# EasyEDA Pro project stm32f103c8t6.eprj, board PCB3_1
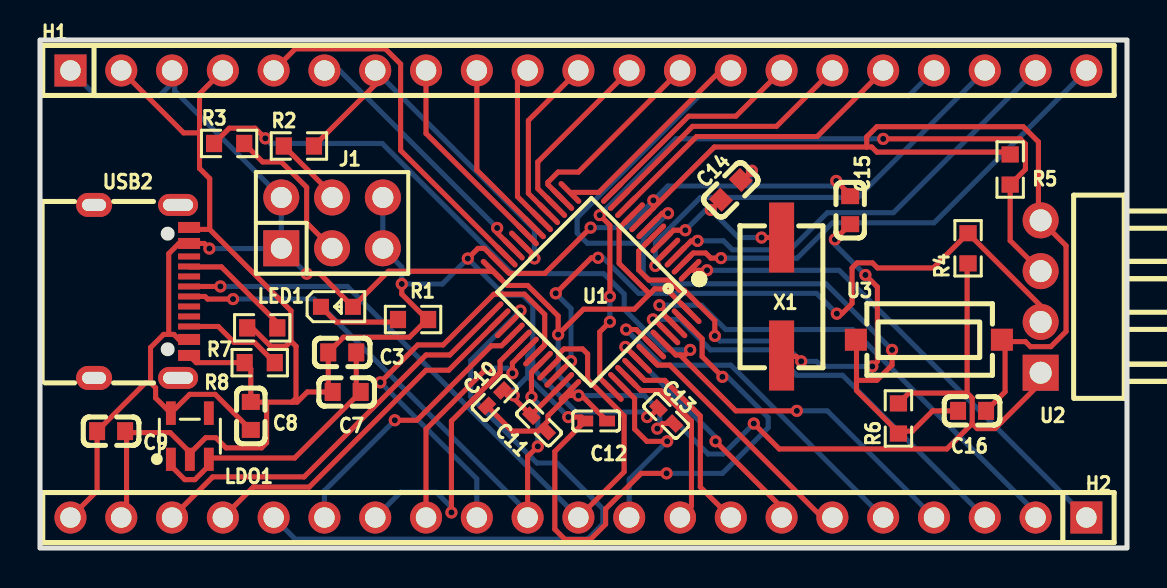
[diagram p6: board, top side]
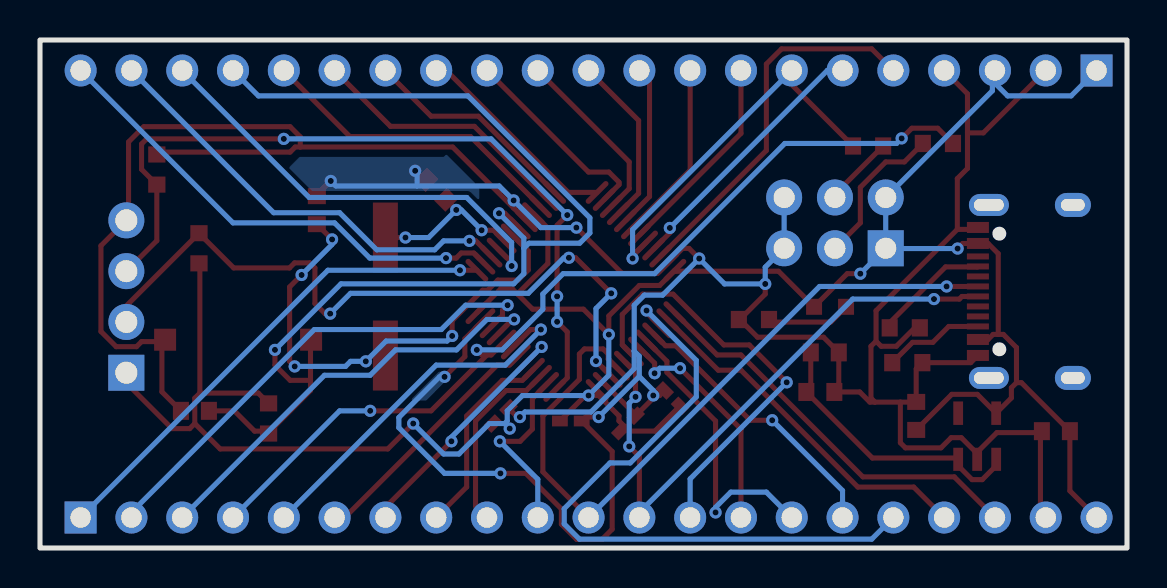
[diagram p7: board, bottom side, seen from below]

Outline 54.36 x 25.4 mm; copper layers: Top Layer, Bottom Layer. Coordinates in mm from the lower left corner of the outline.
Outline path: rectangle 0,25.4 54.36,0
Stack: Top Layer 0.035mm / Dielectric1 1.51mm FR4 er 4.5 / Bottom Layer 0.035mm

## Design rules (mm)
template: JLCPCB Capability(Two Layers Board)
spacing copperThickness1oz (default): track to track 0.102, other pairs 0.152 to 0.3
spacing copperThickness2oz: track to track 0.203, other pairs 0.152 to 0.3
track width copperThickness1oz (default): min 0.127, default 0.254, max 2.54
track width copperThickness2oz: min 0.203, default 0.254, max 2.54
differential pair differentialPair (default): width min 0.127, default 0.254, max 2.54; gap min 0.152, default 0.152
via viaSize (default): diameter min 0.5, default 0.61, max 10; hole min 0.3, default 0.305, max 6.3

## Placement (name value [footprint] x y rotation side)
C3  0.1UF  [C0603]  15.11 9.78 0 top
C7  1uF  [C0603]  15.33 7.8 0 top
C8  1uF  [C0603]  10.54 6.6 270 top
C9  0.1UF  [C0603]  3.56 5.84 180 top
C10  100nF  [C0402]  22.73 7.49 225 top
C11  100nF  [C0402]  24.95 6.23 315 top
C12  100nF  [C0402]  27.81 6.35 0 top
C13  100nF  [C0402]  31.31 6.61 315 top
C14  18pF  [C0603]  34.54 17.91 225 top
C15  18pF  [C0603]  40.51 16.89 270 top
C16  0.1UF  [C0603]  46.61 6.86 0 top
H1  HC-PZ254-11.5L-1x21PZ  [HDR-TH_21P-P2.54-V-M]  26.92 23.88 0 top
H2  HC-PZ254-11.5L-1x21PZ  [HDR-TH_21P-P2.54-V-M]  26.92 1.52 180 top
J1  2.54-2*3P针  [HDR-TH_6P-P2.54-V-M-R2-C3-S2.54-1]  14.61 16.26 0 top
LDO1  ME6211C33M5G-N  [SOT-23-5_L3.0-W1.7-P0.95-LS2.8-BL]  7.49 5.59 0 top
LED1  NCD0603Y2  [LED0603-RD]  14.85 12.06 0 top
R1  1kΩ  [R0603]  18.66 11.42 0 top
R2  10kΩ  [R0603]  12.95 20.1 0 top
R3  10kΩ  [R0603]  9.46 20.23 0 top
R4  10kΩ  [R0603]  46.41 14.99 270 top
R5  10kΩ  [R0603]  48.51 18.92 270 top
R6  10kΩ  [R0603]  42.93 6.48 90 top
R7  5.1kΩ  [R0603]  11.11 11.01 0 top
R8  5.1kΩ  [R0603]  10.99 9.27 0 top
U1  STM32F103C8T6  [LQFP-48_L7.0-W7.0-P0.50-LS9.0-BL]  27.56 12.83 135 top
U2  2541WR-04P  [HDR-TH_4P-P2.54-H-M-W10.4-N]  50.04 12.57 90 top
U3  KEYRESET  [SW-SMD_HX-TS-1101-C-W]  44.45 10.41 0 top
USB2  TYPE-C 16PIN 2MD(073)  [USB-C-SMD_TYPE-C-6PIN-2MD-073]  5.08 12.83 270 top
X1  8MHz  [CRYSTAL-SMD_L7.0-W4.1-LS7.6]  37.08 12.57 90 top

## Footprints (pads in the part's own frame, mm; a bottom-side part is the same pattern mirrored in y, then rotated)
C0402
  rect 0.79x0.54 smd: 1(-0.545,0) 2(0.545,0)
C0603
  rect 0.8x0.9 smd: 1(-0.7,0) 2(0.7,0)
CRYSTAL-SMD_L7.0-W4.1-LS7.6
  rect 3.5x1.25 smd: 1(-2.95,0) 2(2.95,0)
HDR-TH_4P-P2.54-H-M-W10.4-N
  rect 1.8x1.8 hole 1.1: 1(-3.81,0)
  round 1.8 hole 1.1: 2(-1.27,0) 3(1.27,0) 4(3.81,0)
HDR-TH_6P-P2.54-V-M-R2-C3-S2.54-1
  rect 1.8x1.8 hole 1.05: 1(-2.54,-1.27)
  round 1.8 hole 1.05: 2(-2.54,1.27) 3(0,-1.27) 4(0,1.27) 5(2.54,-1.27) 6(2.54,1.27)
HDR-TH_21P-P2.54-V-M
  rect 1.6x1.6 hole 1.02: 1(-25.4,0)
  round 1.6 hole 1.02: 2(-22.86,0) 3(-20.32,0) 4(-17.78,0) 5(-15.24,0) 6(-12.7,0) 7(-10.16,0) 8(-7.62,0) 9(-5.08,0) 10(-2.54,0) 11(0,0) 12(2.54,0) 13(5.08,0) 14(7.62,0) 15(10.16,0) 16(12.7,0) 17(15.24,0) 18(17.78,0) 19(20.32,0) 20(22.86,0) 21(25.4,0)
LED0603-RD
  rect 0.8x0.8 smd: 1(-0.799,0) 2(0.799,0)
LQFP-48_L7.0-W7.0-P0.50-LS9.0-BL
  oval 0.27x1.5 smd: 1(-2.75,-4.25) 2(-2.25,-4.25) 3(-1.75,-4.25) 4(-1.25,-4.25) 5(-0.75,-4.25) 6(-0.25,-4.25) 7(0.25,-4.25) 8(0.75,-4.25) 9(1.25,-4.25) 10(1.75,-4.25) 11(2.25,-4.25) 12(2.75,-4.25) 25(2.75,4.25) 26(2.25,4.25) 27(1.75,4.25) 28(1.25,4.25) 29(0.75,4.25) 30(0.25,4.25) 31(-0.25,4.25) 32(-0.75,4.25) 33(-1.25,4.25) 34(-1.75,4.25) 35(-2.25,4.25) 36(-2.75,4.25)
  oval 1.5x0.27 smd: 13(4.25,-2.75) 14(4.25,-2.25) 15(4.25,-1.75) 16(4.25,-1.25) 17(4.25,-0.75) 18(4.25,-0.25) 19(4.25,0.25) 20(4.25,0.75) 21(4.25,1.25) 22(4.25,1.75) 23(4.25,2.25) 24(4.25,2.75) 37(-4.25,2.75) 38(-4.25,2.25) 39(-4.25,1.75) 40(-4.25,1.25) 41(-4.25,0.75) 42(-4.25,0.25) 43(-4.25,-0.25) 44(-4.25,-0.75) 45(-4.25,-1.25) 46(-4.25,-1.75) 47(-4.25,-2.25) 48(-4.25,-2.75)
R0603
  rect 0.806x0.864 smd: 1(-0.753,0) 2(0.753,0)
SOT-23-5_L3.0-W1.7-P0.95-LS2.8-BL
  rect 0.49x1.157 smd: 1(-0.95,-1.153) 2(0,-1.153) 3(0.95,-1.153)
  rect 0.49x1.175 smd: 4(0.95,1.153) 5(-0.95,1.153)
SW-SMD_HX-TS-1101-C-W
  rect 1.1x1.1 smd: 1(-3.65,0) 2(3.65,0)
USB-C-SMD_TYPE-C-6PIN-2MD-073
  rect 0.55x1.1 smd: 1(-3.2,2.375) 2(-2.4,2.375) 11(2.4,2.375) 12(3.2,2.375)
  rect 0.3x1.1 smd: 3(-1.75,2.375) 4(-1.25,2.375) 5(-0.75,2.375) 6(-0.25,2.375) 7(0.25,2.375) 8(0.75,2.375) 9(1.25,2.375) 10(1.75,2.375)
  oval 1.1x2 hole 0.6x1.5: 13(-4.325,1.825) 14(4.325,1.825)
  oval 1.2x1.8 hole 0.6x1.2: 13(-4.325,-2.375) 14(4.325,-2.375)

## Nets
+5V: C3.2 C7.2 LDO1.1 LDO1.3
GND: C3.1 C7.1 C8.1 C9.1 C10.1 C11.1 C12.1 C13.1 C14.1 C15.1 C16.2 H1.2 H1.4 H2.20 J1.5 J1.6 LDO1.2 R1.2 R5.1 R7.1 R8.1 U1.8 U1.23 U1.35 U1.47 U2.4 U3.2 USB2.1 USB2.12
VBAT: H2.1 U1.1
VCC: C8.2 C9.2 C10.2 C11.2 C12.2 C13.2 H1.1 H1.3 H2.21 J1.1 J1.2 LDO1.5 LED1.2 R4.2 R6.2 U1.9 U1.24 U1.36 U1.48 U2.1 USB2.2 USB2.11
BOOT0: H2.4 R3.1 U1.44
BOOT1: H1.7 R2.2 U1.20
OSCIN: C14.2 U1.5 X1.2
OSOUT: C15.2 U1.6 X1.1
PA0: H1.17 U1.10
PA1: H1.16 U1.11
PA2: H1.15 U1.12
PA3: H1.14 U1.13
PA4: H1.13 U1.14
PA5: H1.12 U1.15
PA6: H1.11 U1.16
PA7: H1.10 U1.17
PA8: H2.15 U1.29
PA9: H2.14 U1.30
PA10: H2.13 U1.31
PA11: H2.12 U1.32 USB2.7
PA12: H2.11 U1.33 USB2.6
PA15: H2.10 U1.38
PB0: H1.9 U1.18
PB1: H1.8 U1.19
PB3: H2.9 U1.39
PB4: H2.8 U1.40
PB5: H2.7 U1.41
PB6: H2.6 U1.42
PB7: H2.5 U1.43
PB8: H2.3 U1.45
PB9: H2.2 U1.46
PB10: H1.6 U1.21
PB11: H1.5 U1.22
PB12: H2.19 U1.25
PB13: H2.18 U1.26
PB14: H2.17 U1.27
PB15: H2.16 U1.28
PC13: H1.21 U1.2
PC14: H1.20 U1.3
PC15: H1.19 U1.4
RESET: C16.1 H1.18 R6.1 U1.7 U3.1
SWCLK: R5.2 U1.37 U2.3
SWIO: R4.1 U1.34 U2.2
$1N1581: LED1.1 R1.1
$1N1591: J1.3 R3.2
$1N1592: J1.4 R2.1
$1N3762: R7.2 USB2.4
$1N3875: R8.2 USB2.10

Pads without a net: LDO1 4; USB2 3 5 8 9 13 14

## Via types
v1: diameter 0.61, hole 0.305, Top Layer to Bottom Layer, 60 vias

## Routing (per net, layer and track width the routed paths; a pad name or vN(x,y) marks a point on that pad's centre or on a via; arc(x,y) is an arc through that point)
+5V: length 14.3
  Top Layer w0.254: 8.51,4.5 LDO1.3 ; 8.51,4.5 8.51,4.18 7.75,3.42 7.24,3.42 6.54,4.11 LDO1.1 ; 8.51,4.5 12.73,4.5 C7.2 15.81,8.02 C3.2
GND: length 194.9
  Top Layer w0.254: C13.1 30.48,6.55 v1(30.36,6.55) ; 8.48,15.93 8.48,18.47 7.98,18.98 7.98,20.76 ; 8.48,15.93 7.55,15.93 USB2.1 ; 8.48,15.93 12.55,11.87 12.55,10.34 ; 12.55,10.34 12.3,10.09 11.53,10.09 10.61,11.01 R7.1 ; 12.55,10.34 12.8,10.09 12.8,7.49 12.6,7.29 ; v1(27.54,16.02) 25.25,13.73 23.47,13.73 22.22,14.98 21.9,14.98 v1(21.39,14.47) ; 24.45,6.73 C11.1 ; 24.45,6.73 23.69,7.49 v1(23.69,7.62) 23.37,7.62 C10.1 ; 24.45,6.73 24.64,6.73 26.14,8.23 ; v1(26.42,6.55) 27.07,6.55 C12.1 25.74,4.83 25.74,0.94 26.25,0.43 27.52,0.43 28.28,1.19 28.28,1.95 30.06,3.73 v1(31.33,3.73) ; v1(18.09,13.2) 18.09,12.69 19.36,11.42 ; 48.26,10.32 49.28,10.32 49.53,10.07 50.55,10.07 51.31,10.83 51.31,15.11 U2.4 49.93,16.49 49.93,20.3 49.17,21.07 41.85,21.07 41.34,20.56 41.34,20.05 ; 48.26,10.32 48.26,7.81 C16.2 ; 48.26,10.32 48.19,10.32 U3.2 ; 4.06,1.52 4.33,1.79 4.33,5.77 ; 12.6,7.29 12.86,7.29 13.36,7.8 C7.1 14.41,8.02 C3.1 15.17,10.54 18.48,10.54 19.36,11.42 ; 12.6,7.29 11.33,7.29 ; U1.47 33.11,10.46 33.11,9.57 v1(34.13,8.56) ; 41.34,20.05 41.59,20.05 41.85,19.8 48.4,19.8 R5.1 ; 41.34,20.05 33.72,20.05 30.67,17 ; C15.1 40.32,17.85 v1(39.82,18.35) ; 11.33,7.29 11.33,5.26 11.08,5.01 9.3,5.01 8.79,5.52 8.29,5.52 7.52,4.75 ; 11.33,7.29 10.55,7.29 C8.1 10.54,8.96 R8.1 7.81,9.27 USB2.12 ; 7.98,20.76 7.18,20.76 4.06,23.88 ; 7.98,20.76 7.98,22.71 H1.4 ; 19.36,11.42 R1.2 ; 7.52,4.75 7.52,4.46 LDO1.2 ; 7.52,4.75 6.51,5.77 4.33,5.77 ; 4.33,5.77 C9.1 ; C14.1 35.34,18.61 v1(35.6,18.86) ; 30.67,17 U1.8 ; 30.67,17 v1(30.67,17.38)
  Bottom Layer w0.254: 24.64,9.85 24.64,12.13 24.13,12.64 23.22,12.64 v1(21.39,14.47) 20.12,13.2 v1(18.09,13.2) 18.09,14.04 J1.5 J1.6 ; 24.64,9.85 24.39,9.59 24.39,8.58 ; 24.64,9.85 24.64,8.96 26.8,6.8 30.11,6.8 v1(30.36,6.55) ; v1(39.82,18.35) 39.56,18.1 35.5,18.1 ; v1(31.33,3.73) 34.13,3.73 36.41,6.02 36.41,6.53 34.38,8.56 v1(34.13,8.56) ; v1(35.6,18.86) 35.5,18.76 35.5,18.1 ; v1(27.54,16.02) 29.31,16.02 v1(30.67,17.38) 31.39,18.1 35.5,18.1 ; v1(23.69,7.62) 23.69,7.88 24.39,8.58 ; 24.39,8.58 v1(26.42,6.55)
VBAT: length 24.9
  Top Layer w0.254: v1(33.36,13.89) U1.1
  Bottom Layer w0.254: H2.1 39.96,13.89 v1(33.36,13.89)
VCC: length 130.6
  Top Layer w0.254: U1.48 31.32,12.96 30.74,12.96 30.48,12.7 ; R6.2 43.44,7.75 46.36,7.75 ; 26.75,7.62 v1(26.93,7.62) 27.08,7.62 C12.2 ; 26.75,7.62 U1.36 ; 26.75,7.62 26.42,7.62 25.4,6.61 25.4,6.35 25.15,6.1 ; 25.15,6.1 24.9,5.85 23.61,5.85 C10.2 ; 25.15,6.1 C11.2 ; v1(35.69,6.22) 36.96,4.95 45.35,4.95 46.62,6.22 ; v1(13.33,13.72) 13.99,13.72 15.65,12.06 17.43,13.84 22.56,13.84 U1.24 23.37,13.13 24.39,13.13 25.91,11.6 v1(25.91,10.67) 27.18,11.94 29.72,11.94 30.48,12.7 ; v1(30.87,5.97) 31.12,6.22 31.7,6.22 ; 30.48,12.7 28.96,14.23 28.96,16 U1.9 ; 46.36,7.75 46.62,7.49 46.62,6.22 ; 46.36,7.75 46.36,14.19 R4.2 ; v1(8.47,14.97) 8.22,15.23 USB2.2 6.95,15.23 6.44,14.72 6.44,10.68 ; 46.62,6.22 46.87,5.97 47.75,5.97 50.04,8.26 U2.1 ; 5.53,8.27 5.78,8.01 5.78,7.5 LDO1.5 7.48,7.68 8.76,7.68 C8.2 ; 5.53,8.27 5.53,10.02 6.19,10.68 6.44,10.68 ; 5.53,8.27 5.28,8.27 C9.2 2.86,2.86 1.52,1.52 ; 6.44,10.68 6.69,10.68 6.95,10.43 USB2.11
  Bottom Layer w0.254: 1.52,23.88 2.79,22.61 5.97,22.61 6.73,23.37 ; H1.3 6.73,23.75 6.73,23.37 ; 31.12,6.22 v1(30.87,5.97) ; 31.12,6.22 31.88,6.22 33.41,4.7 34.17,4.7 v1(35.69,6.22) ; 31.12,6.22 30.99,6.35 30.99,6.86 30.23,7.62 v1(26.93,7.62) 25.91,8.64 v1(25.91,10.67) ; J1.1 12.05,14.97 v1(8.47,14.97) ; J1.1 v1(13.33,13.72) ; J1.1 J1.2 6.73,22.86 6.73,23.37
BOOT0: length 47
  Top Layer w0.254: U1.44 31.79,9.65 32,9.65 ; v1(32.51,9.91) 32.26,9.65 32,9.65 ; R3.1 9.47,20.99 10.76,20.99 v1(11.27,20.48) ; 32,9.65 34.8,6.86 v1(37.85,6.86)
  Bottom Layer w0.254: H2.4 39.37,6.86 v1(37.85,6.86) ; v1(32.51,9.91) 31.24,9.91 29.21,11.94 29.21,12.7 28.19,13.72 23.62,13.72 17.11,20.23 11.52,20.23 v1(11.27,20.48)
BOOT1: length 18.9
  Top Layer w0.254: v1(24.72,14.48) 24.72,14.6 U1.20 ; R2.2 16.76,23.16 H1.7
  Bottom Layer w0.254: H1.7 24.72,15.92 v1(24.72,14.48)
OSCIN: length 7.9
  Top Layer w0.254: C14.2 v1(33.54,16.9) ; v1(36.08,15.52) X1.2 ; v1(32.27,15.89) 31.68,15.89 U1.5
  Bottom Layer w0.254: v1(32.27,15.89) 33.29,16.9 v1(33.54,16.9) 34.92,15.52 v1(36.08,15.52)
OSOUT: length 25.7
  Top Layer w0.254: X1.1 37.3,9.59 37.81,9.59 v1(38.06,9.33) ; v1(33.75,10.6) 33.75,11.37 32.22,12.89 31.97,12.89 31.46,13.4 30.44,13.4 29.94,13.91 29.94,14.85 U1.6 ; C15.2 v1(39.75,15.43) ; v1(41.62,9.08) 41.87,9.33 41.87,13.05 v1(41.27,13.65)
  Bottom Layer w0.254: v1(39.75,15.43) 39.75,15.18 v1(41.27,13.65) ; v1(33.75,10.6) 34,10.35 37.05,10.35 v1(38.06,9.33) 38.83,9.33 39.08,9.08 v1(41.62,9.08)
PA0: length 15.7
  Top Layer w0.254: H1.17 38.86,20.57 32.83,20.57 U1.10
PA1: length 13.3
  Top Layer w0.254: U1.11 32.63,21.08 36.83,21.08 39.62,23.88
PA2: length 11
  Top Layer w0.254: U1.12 32.43,21.59 34.8,21.59 37.08,23.88
PA3: length 10.6
  Top Layer w0.254: 26.5,17.78 27.94,17.78 34.04,23.88 H1.14
PA4: length 10.1
  Top Layer w0.254: U1.14 25.4,18.17 25.4,18.29 25.91,18.8 26.92,18.8 H1.13
PA5: length 9.1
  Top Layer w0.254: 29.46,23.88 24.89,19.3 24.89,17.97 U1.15
PA6: length 8.6
  Top Layer w0.254: H1.11 24.42,21.37 24.42,17.73 U1.16
PA7: length 8.2
  Top Layer w0.254: U1.17 23.88,17.57 23.88,23.37 H1.10
PA8: length 14.9
  Top Layer w0.254: v1(20.57,1.78) 20.57,6.35 23.01,8.78 23.01,9.34 U1.29
  Bottom Layer w0.254: v1(20.57,1.78) 20.57,2.03 19.81,2.79 18.03,2.79 H2.15
PA9: length 11.7
  Top Layer w0.254: 19.3,1.52 19.3,5.94 v1(22.35,8.99) ; U1.30 23.62,9.24 v1(23.62,8.74)
  Bottom Layer w0.254: v1(22.35,8.99) 23.37,8.99 v1(23.62,8.74)
PA10: length 21.5
  Top Layer w0.254: v1(17.02,8.28) 18.89,10.15 20.16,10.15 22.7,12.69 24.22,12.69 25.24,11.68 25.24,10.15 24.73,9.65
  Bottom Layer w0.254: v1(17.02,8.28) 21.84,3.46 21.84,1.52
PA11: length 30
  Top Layer w0.254: v1(24.58,7.56) 24.58,8.78 U1.32 ; v1(24.89,5.08) 24.38,4.57 H2.12 ; v1(9.65,12.45) 8.38,12.45 8.25,12.58 USB2.7
  Bottom Layer w0.254: H2.12 24.38,1.78 13.72,12.45 v1(9.65,12.45) ; v1(24.58,7.56) 24.89,7.24 v1(24.89,5.08)
PA12: length 36.8
  Top Layer w0.254: v1(9.02,13.08) USB2.6 ; U1.33 25.95,9.45 25.95,9.7 26.2,9.95 27.13,9.95 27.38,9.7 27.38,8.43 29.21,6.6 29.21,3.81 H2.11
  Bottom Layer w0.254: H2.11 15.37,13.08 v1(9.02,13.08)
PA15: length 9.1
  Top Layer w0.254: 28.97,8.23 29.73,7.47 29.73,5.95 30.35,5.33 v1(31.36,5.33)
  Bottom Layer w0.254: v1(31.36,5.33) 29.46,3.44 29.46,1.52
PB0: length 9.1
  Top Layer w0.254: U1.18 21.84,18.9 21.84,23.88
PB1: length 10.3
  Top Layer w0.254: U1.19 19.3,20.73 19.3,23.88
PB3: length 9.2
  Top Layer w0.254: H2.9 32.58,2.1 32.58,6.35 31.05,7.87 30.04,7.87 U1.39
PB4: length 10
  Top Layer w0.254: U1.40 30.24,8.38 31.24,8.38 33.02,6.6 33.02,3.05 H2.8
PB5: length 12.8
  Top Layer w0.254: v1(33.78,5.33) 37.08,2.03 37.08,1.52 ; v1(29.27,10.05) U1.41
  Bottom Layer w0.254: v1(29.27,10.05) 33.78,5.54 v1(33.78,5.33)
PB6: length 12.6
  Top Layer w0.254: 39.62,1.52 39.12,1.52 31.5,9.14 30.89,9.14 30.39,9.65
PB7: length 18.6
  Top Layer w0.254: v1(29.31,10.92) 29.82,10.92 U1.43
  Bottom Layer w0.254: H2.5 34.54,9.14 31.09,9.14 v1(29.31,10.92)
PB8: length 21.8
  Top Layer w0.254: U1.45 30.72,11.43 v1(30.65,11.43)
  Bottom Layer w0.254: v1(30.65,11.43) 32,11.43 33.53,9.91 36.58,9.91 37.85,8.64 40.13,8.64 47.24,1.52
PB9: length 24.8
  Top Layer w0.254: U1.46 31.23,11.63 31.23,11.89 v1(30.97,12.14)
  Bottom Layer w0.254: v1(30.97,12.14) 33.07,12.14 34.29,10.92 40.64,10.92 49.78,1.78 H2.2
PB10: length 13.3
  Top Layer w0.254: v1(22.86,16) 22.86,15.76 U1.21
  Bottom Layer w0.254: H1.6 14.99,23.88 v1(22.86,16)
PB11: length 18.9
  Top Layer w0.254: 11.68,23.88 12.77,24.96 17.27,24.96 18.03,24.2 18.03,19.88 U1.22
PB12: length 20.2
  Top Layer w0.254: U1.25 20.5,9.65 19.3,9.65 13.21,3.56 8.64,3.56 H2.19
PB13: length 17.9
  Top Layer w0.254: U1.26 20.44,8.89 19.3,8.89 13.46,3.05 10.67,3.05 H2.18
PB14: length 33.4
  Top Layer w0.254: v1(24.03,11.87) 24.03,11.77 U1.27
  Bottom Layer w0.254: 11.68,1.52 12.77,0.44 27.38,0.44 28.14,1.21 28.14,1.97 25.86,4.25 24.84,4.25 21.54,7.56 21.54,9.38 v1(24.03,11.87)
PB15: length 14
  Top Layer w0.254: v1(17.74,6.39) 18.84,6.39 22.57,10.11 23.08,10.11 U1.28
  Bottom Layer w0.254: v1(17.74,6.39) 14.22,2.87 H2.16
PC13: length 24.4
  Top Layer w0.254: 32.16,14.24 32.66,14.75 33.29,14.75 33.55,14.5 v1(34.05,14.5)
  Bottom Layer w0.254: v1(34.05,14.5) 37.86,14.5 39.62,16.26 44.7,16.26 H1.21
PC14: length 22.2
  Top Layer w0.254: v1(32.88,15.36) 32.56,15.36 U1.3
  Bottom Layer w0.254: H1.20 42.67,16.76 39.37,16.76 37.52,14.91 34.62,14.91 34.17,15.36 v1(32.88,15.36)
PC15: length 22.3
  Top Layer w0.254: v1(30.77,14.1) 30.77,14.27 U1.4
  Bottom Layer w0.254: 47.24,23.88 40.89,17.53 33.02,17.53 30.77,15.28 v1(30.77,14.1)
RESET: length 56.1
  Top Layer w0.254: 40.83,8.38 40.83,7.87 42.86,5.84 43.04,5.84 ; 40.83,8.38 41.85,8.38 42.61,9.14 v1(42.61,9.91) ; 40.83,8.38 40.83,10.39 U3.1 ; 43.04,5.84 R6.1 ; 43.04,5.84 43.62,5.84 44.64,6.86 C16.1 ; U1.7 31.11,16.74 v1(31.4,16.74)
  Bottom Layer w0.254: 30.16,14.99 30.16,15.49 v1(31.4,16.74) ; 30.16,14.99 29.91,15.24 27.37,15.24 26.86,15.75 26.86,16.51 32.95,22.61 43.43,22.61 H1.18 ; 30.16,14.99 30.16,13.72 30.67,13.21 39.3,13.21 v1(42.61,9.91)
SWCLK: length 39.7
  Top Layer w0.254: v1(28.5,12.58) 28.5,16.14 v1(27.99,16.65) ; U2.3 48.51,15.37 R5.2 49.28,18.93 49.28,20.2 49.02,20.46 v1(42.16,20.46) ; U1.37 27.99,8.51 27.99,10.8 v1(28.5,11.31)
  Bottom Layer w0.254: v1(27.99,16.65) 31.8,20.46 v1(42.16,20.46) ; v1(28.5,12.58) v1(28.5,11.31)
SWIO: length 36.1
  Top Layer w0.254: v1(26.55,9.35) U1.34 ; v1(25.79,12.73) 27.57,14.51 v1(27.91,14.51) ; U2.2 50.04,12.11 R4.1 44.67,14 41.88,14 41.62,14.26 40.86,14.26 40.61,14 40.61,12.23 40.1,11.72 v1(39.85,11.72)
  Bottom Layer w0.254: v1(25.79,12.73) 26.55,11.97 v1(26.55,9.35) ; v1(27.91,14.51) 28.16,14.51 29.94,12.73 38.83,12.73 v1(39.85,11.72)
$1N1581: length 4.2
  Top Layer w0.254: R1.1 17.78,11.3 14.81,11.3 LED1.1
$1N1591: length 7.6
  Top Layer w0.254: R3.2 11.13,19.3 12.07,19.3 13.33,18.03 13.33,16.26 J1.3
$1N1592: length 3.6
  Top Layer w0.254: R2.1 14.61,17.69 J1.4
$1N3762: length 5.8
  Top Layer w0.254: R7.2 11.87,11.26 9.07,14.06 7.48,14.06 USB2.4
$1N3875: length 5
  Top Layer w0.254: USB2.10 8.91,11.08 9.71,10.28 10.72,10.28 11.74,9.27

## Copper pours and planes (outline as drawn; the poured copper is in the pictures)
GND on Bottom Layer: 34.04,19.69 32.39,18.03 32.39,16.89 34.04,15.24 34.16,15.24 34.16,8.23 34.19,8.23 35.05,7.37 39.42,7.37 39.88,7.83 39.88,14.2 41.38,14.2 44.05,16.88 41.4,19.53 41.4,19.56 34.16,19.56
